# Altium project Pedal_FootSW.PrjPcb
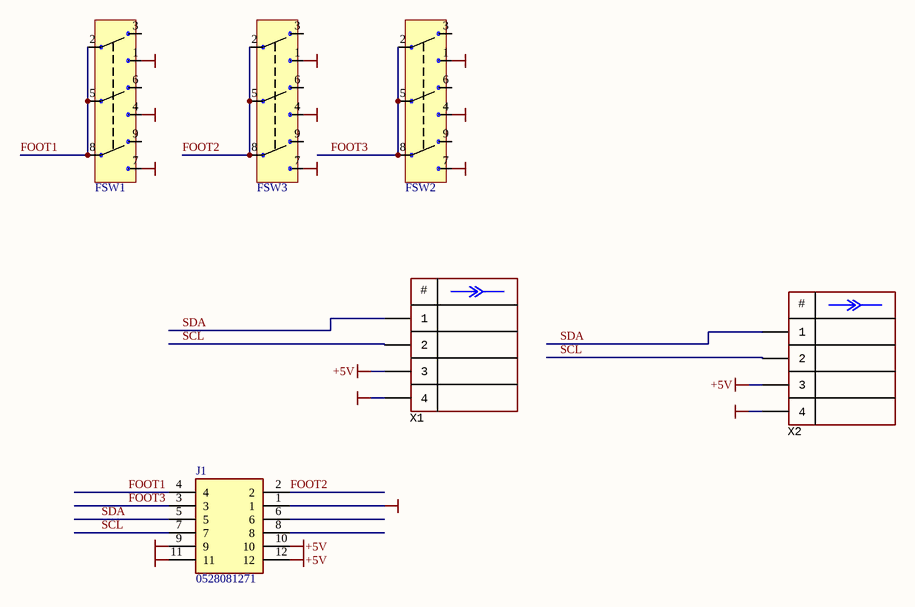
[diagram p0: FootSW.SchDoc]
1 sheet, 6 parts. Net scope: global (net labels, ports and power ports of the same name join across sheets).
Board files: FootSW_old.PcbDoc, FootSW.PcbDoc

## Sheet FootSW.SchDoc
size A4; SheetNumber: 1; SheetTotal: 1

### Parts
FSW1  FootSwitch  [FOOTSW]  (value not drawn)
FSW2  FootSwitch  [FOOTSW]  (value not drawn)
FSW3  FootSwitch  [FOOTSW]  (value not drawn)
J1  0528081271  [AFA11-S12GLA-00]
X1  (no value)  [CON: PBS-4]
X2  (no value)  [CON: PBS-4]

### Nets
+5V: J1.10 J1.12 X1.3 X2.3
GND: FSW1.1 FSW1.4 FSW1.7 FSW2.1 FSW2.4 FSW2.7 FSW3.1 FSW3.4 FSW3.7 J1.1 J1.9 J1.11 X1.4 X2.4
FOOT1: FSW1.2 FSW1.5 FSW1.8 J1.4
FOOT2: FSW3.2 FSW3.5 FSW3.8 J1.2
FOOT3: FSW2.2 FSW2.5 FSW2.8 J1.3
SC~{L}: J1.7 X1.2 X2.2
SDA: J1.5 X1.1 X2.1

Not connected (* = marked no-connect by the designer): FSW1 3 6 9; FSW2 3 6 9; FSW3 3 6 9; J1 6 8

### Notes on the sheet
- (in symbol PBS-4) #

### Library data of the parts
J1 = 0528081271: Connector; Manufacturer_Name: Molex; Datasheet Link: https://www.molex.com/pdm_docs/sd/528082071_sd.pdf; Height: 5.3mm; Manufacturer_Part_Number: 0528081271; System: Connector
X1 X2 = PBS-4: Manufacturer: Connfly; ValueManufacturerPartNumber: Connector, 4pin, 2.54mm, 500VAC, 3A; TypeConnector: Connector; VoltageMax: 500VAC; Pitch: 2.54mm; CurrentMax: 3A; Multichannel: 4pin; CommentText: "Разъем"; HelpURL: https://www.chipdip.ru/product/pbs-4; PartNumber: PBS-4